# Altium schematic sheet PowerSwitching.SchDoc
size A; SheetNumber: 2; SheetTotal: 4
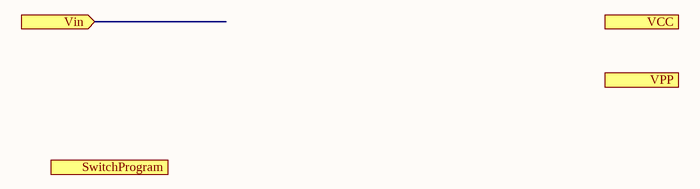
[diagram p0: PowerSwitching.SchDoc]

## Ports
SwitchProgram (in), VCC, Vin (in), VPP